# Altium schematic sheet DD2090_4CAM_FFC_MIPI_4LANE_CAM.SchDoc: =project_title
size Tabloid; PageSetup: Record=PageOptions|CenterHorizontal=True|CenterVertical=True|PrintScale=0.73|XCorrection=1.00|YCorrection=1.00|PrintKind=0|BorderSize=5000000|LeftOffset=0|BottomOffset=0|Orientation=2|PaperLength=1000|PaperWidth=1000|Scale=100|PaperSource=7|PrintQuality=-4|MediaType=1|DitherType=10|PaperKind=A4|PrintScaleMode=1; CompanyName: Luxonis Holding; Organization: Luxonis Holding; Address1: 1925 Harmony Park Drive; Address2: Westminster, CO; Address3: 80234; Address4: United States; SheetNumber: 6; SheetTotal: 12
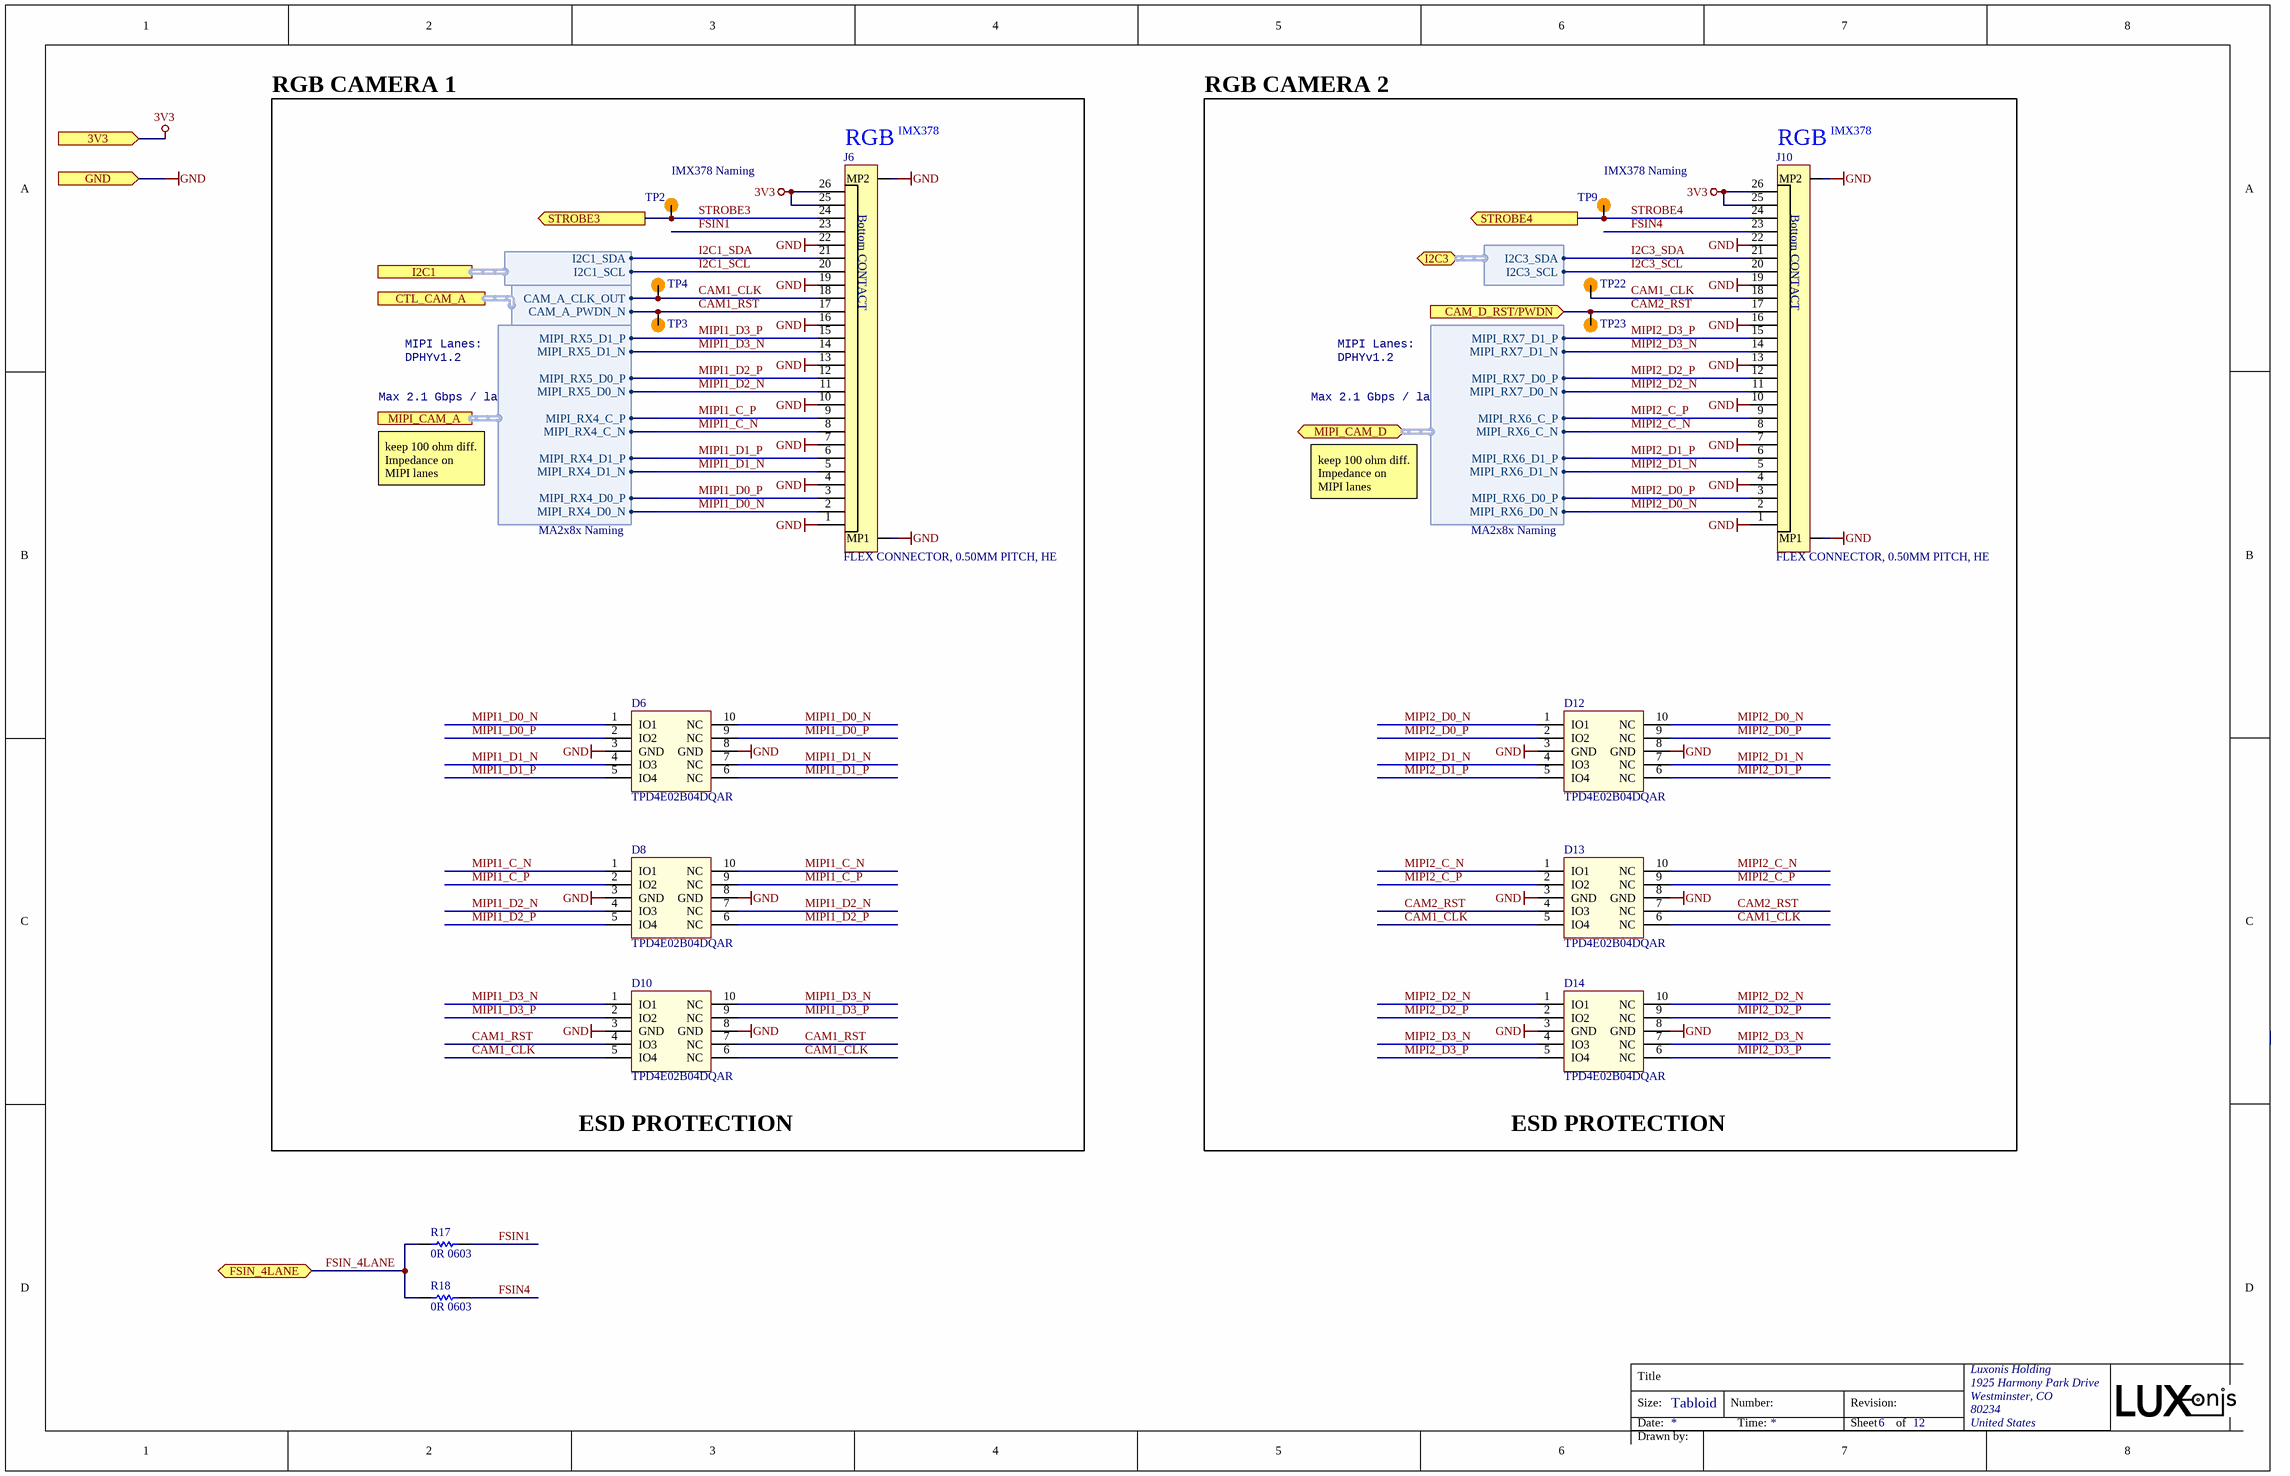
[diagram p0: DD2090_4CAM_FFC_MIPI_4LANE_CAM.SchDoc]

## Parts
D6  TPD4E02B04DQAR  [TPD4E02B04DQAR]
D8  TPD4E02B04DQAR  [TPD4E02B04DQAR]
D10  TPD4E02B04DQAR  [TPD4E02B04DQAR]
D12  TPD4E02B04DQAR  [TPD4E02B04DQAR]
D13  TPD4E02B04DQAR  [TPD4E02B04DQAR]
D14  TPD4E02B04DQAR  [TPD4E02B04DQAR]
J6  FLEX CONNECTOR, 0.50MM PITCH, HE  [F32R-1A7H1-11026]
J10  FLEX CONNECTOR, 0.50MM PITCH, HE  [F32R-1A7H1-11026]
R17  0R 0603  [RESC0603(1608)_N]
R18  0R 0603  [RESC0603(1608)_N]
TP2  TP100_200_NS  [TP100_200_NS]  (value not drawn)  (no BOM)
TP3  TP100_200_NS  [TP100_200_NS]  (value not drawn)  (no BOM)
TP4  TP100_200_NS  [TP100_200_NS]  (value not drawn)  (no BOM)
TP9  TP100_200_NS  [TP100_200_NS]  (value not drawn)  (no BOM)
TP22  TP100_200_NS  [TP100_200_NS]  (value not drawn)  (no BOM)
TP23  TP100_200_NS  [TP100_200_NS]  (value not drawn)  (no BOM)

## Ports
3V3 (in), CAM_D_RST/PWDN (in), CTL_CAM_A (harness CTL_CAM_A), FSIN_4LANE (bidir), GND (in), I2C1 (harness I2C1), I2C3 (bidir, harness I2C3), MIPI_CAM_A (harness MIPI_CAM_A), MIPI_CAM_D (bidir, harness MIPI_CAM_D), STROBE3 (out), STROBE4 (out)

## Harnesses
I2C1: I2C1_SDA, I2C1_SCL
MIPI_CAM_A: MIPI_RX5_D0_P, MIPI_RX5_D0_N, MIPI_RX4_D0_P, MIPI_RX4_D0_N, MIPI_RX4_C_P, MIPI_RX4_C_N, MIPI_RX4_D1_N, MIPI_RX4_D1_P, MIPI_RX5_D1_P, MIPI_RX5_D1_N
CTL_CAM_A: CAM_A_PWDN_N, CAM_A_CLK_OUT
MIPI_CAM_D: MIPI_RX6_C_N, MIPI_RX6_C_P, MIPI_RX6_D0_N, MIPI_RX6_D0_P, MIPI_RX6_D1_N, MIPI_RX6_D1_P, MIPI_RX7_D0_N, MIPI_RX7_D0_P, MIPI_RX7_D1_N, MIPI_RX7_D1_P
I2C3: I2C3_SCL, I2C3_SDA

## Nets
3V3: J6.25 J6.26 J10.25 J10.26 ; port 3V3
GND: D6.3(GND) D6.8(GND) D8.3(GND) D8.8(GND) D10.3(GND) D10.8(GND) D12.3(GND) D12.8(GND) D13.3(GND) D13.8(GND) D14.3(GND) D14.8(GND) J6.1 J6.4 J6.7 J6.10 J6.13 J6.16 J6.19 J6.22 J6.MP1 J6.MP2 J10.1 J10.4 J10.7 J10.10 J10.13 J10.16 J10.19 J10.22 J10.MP1 J10.MP2 ; port GND
CAM1_CLK: D10.5(IO4) D10.6(NC) D13.5(IO4) D13.6(NC) J6.18 J10.18 TP4.1 TP22.1 ; port CTL_CAM_A.CAM_A_CLK_OUT
CAM1_RST: D10.4(IO3) D10.7(NC) J6.17 TP3.1 ; port CTL_CAM_A.CAM_A_PWDN_N
CAM2_RST: D13.4(IO3) D13.7(NC) J10.17 TP23.1 ; port CAM_D_RST/PWDN
FSIN1: J6.23 R17.2
FSIN4: J10.23 R18.2
FSIN_4LANE: R17.1 R18.1 ; port FSIN_4LANE
I2C1_SCL: J6.20 ; port I2C1.I2C1_SCL
I2C1_SDA: J6.21 ; port I2C1.I2C1_SDA
I2C3_SCL: J10.20 ; port I2C3.I2C3_SCL
I2C3_SDA: J10.21 ; port I2C3.I2C3_SDA
MIPI1_C_N: D8.1(IO1) D8.10(NC) J6.8 ; port MIPI_CAM_A.MIPI_RX4_C_N
MIPI1_C_P: D8.2(IO2) D8.9(NC) J6.9 ; port MIPI_CAM_A.MIPI_RX4_C_P
MIPI1_D0_N: D6.1(IO1) D6.10(NC) J6.2 ; port MIPI_CAM_A.MIPI_RX4_D0_N
MIPI1_D0_P: D6.2(IO2) D6.9(NC) J6.3 ; port MIPI_CAM_A.MIPI_RX4_D0_P
MIPI1_D1_N: D6.4(IO3) D6.7(NC) J6.5 ; port MIPI_CAM_A.MIPI_RX4_D1_N
MIPI1_D1_P: D6.5(IO4) D6.6(NC) J6.6 ; port MIPI_CAM_A.MIPI_RX4_D1_P
MIPI1_D2_N: D8.4(IO3) D8.7(NC) J6.11 ; port MIPI_CAM_A.MIPI_RX5_D0_N
MIPI1_D2_P: D8.5(IO4) D8.6(NC) J6.12 ; port MIPI_CAM_A.MIPI_RX5_D0_P
MIPI1_D3_N: D10.1(IO1) D10.10(NC) J6.14 ; port MIPI_CAM_A.MIPI_RX5_D1_N
MIPI1_D3_P: D10.2(IO2) D10.9(NC) J6.15 ; port MIPI_CAM_A.MIPI_RX5_D1_P
MIPI2_C_N: D13.1(IO1) D13.10(NC) J10.8 ; port MIPI_CAM_D.MIPI_RX6_C_N
MIPI2_C_P: D13.2(IO2) D13.9(NC) J10.9 ; port MIPI_CAM_D.MIPI_RX6_C_P
MIPI2_D0_N: D12.1(IO1) D12.10(NC) J10.2 ; port MIPI_CAM_D.MIPI_RX6_D0_N
MIPI2_D0_P: D12.2(IO2) D12.9(NC) J10.3 ; port MIPI_CAM_D.MIPI_RX6_D0_P
MIPI2_D1_N: D12.4(IO3) D12.7(NC) J10.5 ; port MIPI_CAM_D.MIPI_RX6_D1_N
MIPI2_D1_P: D12.5(IO4) D12.6(NC) J10.6 ; port MIPI_CAM_D.MIPI_RX6_D1_P
MIPI2_D2_N: D14.1(IO1) D14.10(NC) J10.11 ; port MIPI_CAM_D.MIPI_RX7_D0_N
MIPI2_D2_P: D14.2(IO2) D14.9(NC) J10.12 ; port MIPI_CAM_D.MIPI_RX7_D0_P
MIPI2_D3_N: D14.4(IO3) D14.7(NC) J10.14 ; port MIPI_CAM_D.MIPI_RX7_D1_N
MIPI2_D3_P: D14.5(IO4) D14.6(NC) J10.15 ; port MIPI_CAM_D.MIPI_RX7_D1_P
STROBE3: J6.24 TP2.1 ; port STROBE3
STROBE4: J10.24 TP9.1 ; port STROBE4

## Notes on the sheet
- RGB CAMERA 1
- RGB CAMERA 2
- (near J6) RGB
- (near J6) IMX378
- (near J10) RGB
- (near J10) IMX378
- (near TP2) IMX378 Naming
- (near TP9) IMX378 Naming
- MIPI Lanes:
- DPHYv1.2
- Max 2.1 Gbps / lane
- keep 100 ohm diff. Impedance on MIPI lanes
- MA2x8x Naming
- ESD PROTECTION
- Title
- Size:
- Date:
- Tabloid
- Number:
- Time:
- Revision:
- Sheet
- of
- Drawn by:
- (in symbol F32R-1A7H1-11026) Bottom CONTACT

## Library data of the parts
D6 D8 D10 D12-D14 = TPD4E02B04DQAR: TVS DIODE 3.6V 8.8V 10USON 8.8V (Typ) Clamp 5A (8/20µs) Ipp Tvs Diode Surface Mount 10-USON (2.5x1); Manufacturer 1: Texas Instruments; Number of Bidirectional Channels: 4; Min Breakdown Voltage: 5.5V; Peak Pulse Power: 17W; Power Line Protection: No; Interface: USB,HDMI; Supplier 1: Digi-Key; Manufacturer Part Number 1: TPD4E02B04DQAR; Stock 1: 25615; Pricing 1: 1=0.69000, 10=0.60800, 100=0.46650, 500=0.36874, 1000=0.29499 (USD); RoHS: Yes; Mount: Surface Mount; Number of Pins: 10; Min Operating Temperature: -40°C; Max Operating Temperature: 125°C; Packaging: Cut Tape; Reverse Standoff Voltage: 3.6V; Clamping Voltage: 8.8V; Operating Supply Voltage: 3.6V; Peak Pulse Current: 5A; Number of Channels: 4; Composition: Zener; REACH SVHC: No SVHC; Lead Free: Lead Free; ComponentLink1URL: http://www.ti.com/general/docs/lit/getliterature.tsp?genericPartNumber=TPD4E02B04&amp;&amp;fileType=pdf&src-supplier=Element14; ComponentLink1Description: http://www.ti.com/general/docs/lit/getliterature.tsp?genericPartNumber=TPD4E02B04&amp;&amp;fileType=pdf&src-supplier=Element14; ComponentLink2URL: http://www.ti.com/lit/ds/symlink/tpd4e02b04.pdf?src-supplier=Farnell; ComponentLink2Description: http://www.ti.com/lit/ds/symlink/tpd4e02b04.pdf?src-supplier=Farnell; ComponentLink3URL: http://www.ti.com/lit/ds/symlink/tpd4e02b04.pdf?src-supplier=Newark; ComponentLink3Description: http://www.ti.com/lit/ds/symlink/tpd4e02b04.pdf?src-supplier=Newark; ComponentLink4URL: http://www.ti.com/lit/ds/symlink/tpd4e02b04.pdf?src-supplier=Digi-Key; ComponentLink4Description: http://www.ti.com/lit/ds/symlink/tpd4e02b04.pdf?src-supplier=Digi-Key; Supplier Part Number 1: 296-43875-1-ND
J6 J10 = F32R-1A7H1-11026: 26 Position FFC, FPC Connector Contacts, Bottom 0.020" (0.50mm) Surface Mount, Right Angle; Manufacturer 1: Amphenol ICC (FCI); Number of Positions: 26; Voltage Rating: 50V; Current Rating: 500mA; Pitch: 0.02inch; Supplier 1: Digi-Key; Manufacturer Part Number 1: F32R-1A7H1-11026; RoHS: Yes; Category: Connectors; Pricing 1: 1=0.77, 10=0.721, 100=0.5529, 500=0.4808 (USD); Mount: Surface Mount; Contact Plating: Tin; Contact Material: Bronze; Min Operating Temperature: -40°C; Max Operating Temperature: 105°C; Packaging: Tape and Reel; Termination: Solder; Flammability Rating: UL94 V-0; ComponentLink1URL: https://cdn.amphenol-icc.com/media/wysiwyg/files/drawing/f32r-f32j.pdf; ComponentLink1Description: https://cdn.amphenol-icc.com/media/wysiwyg/files/drawing/f32r-f32j.pdf; Stock 1: 1709; Supplier Part Number 1: 609-F32R-1A7H1-11026CT-ND
R17 R18 = CRCW06030000Z0EA: RES SMD 0 OHM JUMPER 1/10W 0603 0 Ohms Jumper 0.1W, 1/10W Chip Resistor 0603 (1608 Metric) Automotive AEC-Q200 Thick Film; Manufacturer 1: Vishay; Manufacturer Part Number 1: CRCW0603-0000Z0EA; Resistance: 0mR; Power Rating: 100mW; Voltage Rating: 75V; Temperature Coefficient: 100ppm/°C; Tolerance: 5%; Current Rating: 2A; Supplier 1: Digi-Key; Stock 1: 742743; Pricing 1: 1=0.100000, 10=0.034000, 25=0.024400, 50=0.018600, 100=0.013800, 250=0.010480, 500=0.008400, 1000=0.006180 (USD); RoHS: Yes; Mount: Surface Mount; Case/Package: 0603; Weight: 7.1E-05oz; Contact Plating: Tin,Lead; Case Code (Metric): 1608; Case Code (Imperial): 0603; Min Operating Temperature: -55°C; Max Operating Temperature: 155°C; Composition: Thick Film; Termination: SMD/SMT; Packaging: Tape and Reel; Package Quantity: 1; Number of Terminations: 2; Military Standard: Not; Max Power Dissipation: 100mW; Voltage Rating (DC): 75V; Features: Automotive AEC-Q200; Working Voltage: 75V; Length: 1.55mm; Height: 0.02inch; Width: 0.033inch; Depth: 0.85mm; Radiation Hardening: No; Lead Free: Lead Free; REACH SVHC: Unknown; ComponentLink1URL: https://datasheet.ciiva.com/2461/dcrcwe3-2461968.pdf?src-supplier=Digi-Key; ComponentLink1Description: https://datasheet.ciiva.com/2461/dcrcwe3-2461968.pdf?src-supplier=Digi-Key; ComponentLink2URL: https://datasheet.ciiva.com/2461/dcrcwe3-2461969.pdf?src-supplier=Digi-Key; ComponentLink2Description: https://datasheet.ciiva.com/2461/dcrcwe3-2461969.pdf?src-supplier=Digi-Key; ComponentLink3URL: https://datasheet.ciiva.com/2461/dcrcwe3-2461970.pdf?src-supplier=Digi-Key; ComponentLink3Description: https://datasheet.ciiva.com/2461/dcrcwe3-2461970.pdf?src-supplier=Digi-Key; ComponentLink4URL: https://datasheet.ciiva.com/8340/dcrcwe3-8340197.pdf?src-supplier=Avnet; ComponentLink4Description: https://datasheet.ciiva.com/8340/dcrcwe3-8340197.pdf?src-supplier=Avnet; ComponentLink5URL: https://datasheet.ciiva.com/16941/dcrcw-16941302.pdf?src-supplier=Avnet+Europe; ComponentLink5Description: https://datasheet.ciiva.com/16941/dcrcw-16941302.pdf?src-supplier=Avnet+Europe; ComponentLink6URL: https://datasheet.ciiva.com/16199/dcrcwe3-16199063.pdf?src-supplier=Future+Electronics; ComponentLink6Description: https://datasheet.ciiva.com/16199/dcrcwe3-16199063.pdf?src-supplier=Future+Electronics; ComponentLink7URL: https://datasheet.ciiva.com/16725/70201119-16725175.pdf?src-supplier=Allied+Electronics; ComponentLink7Description: https://datasheet.ciiva.com/16725/70201119-16725175.pdf?src-supplier=Allied+Electronics; ComponentLink8URL: https://datasheet.ciiva.com/26316/fld-crcw-e3-data-en-26316615.pdf?src-supplier=Distrelec; ComponentLink8Description: https://datasheet.ciiva.com/26316/fld-crcw-e3-data-en-26316615.pdf?src-supplier=Distrelec; ComponentLink9URL: https://datasheet.ciiva.com/5544/dcrcwe3-109170-5544344.pdf?src-supplier=Mouser; ComponentLink9Description: https://datasheet.ciiva.com/5544/dcrcwe3-109170-5544344.pdf?src-supplier=Mouser; ComponentLink10URL: https://datasheet.ciiva.com/7841/1720486-7841816.pdf?src-supplier=Element14; ComponentLink10Description: https://datasheet.ciiva.com/7841/1720486-7841816.pdf?src-supplier=Element14; ComponentLink11URL: https://datasheet.ciiva.com/7841/1720486-7841817.pdf?src-supplier=Element14; ComponentLink11Description: https://datasheet.ciiva.com/7841/1720486-7841817.pdf?src-supplier=Element14; ComponentLink12URL: https://datasheet.ciiva.com/7841/125364-7841818.pdf?src-supplier=Element14; ComponentLink12Description: https://datasheet.ciiva.com/7841/125364-7841818.pdf?src-supplier=Element14; ComponentLink13URL: https://datasheet.ciiva.com/16721/70201119-16721450.pdf?src-supplier=Allied+Electronics; ComponentLink13Description: https://datasheet.ciiva.com/16721/70201119-16721450.pdf?src-supplier=Allied+Electronics; Supplier Part Number 1: 541-0.0GCT-ND
TP2-TP4 TP9 TP22 TP23 = TEST_POINT